# EAGLE design NitroxAnalyzer_v_0_3 (EAGLE 7.3.0)
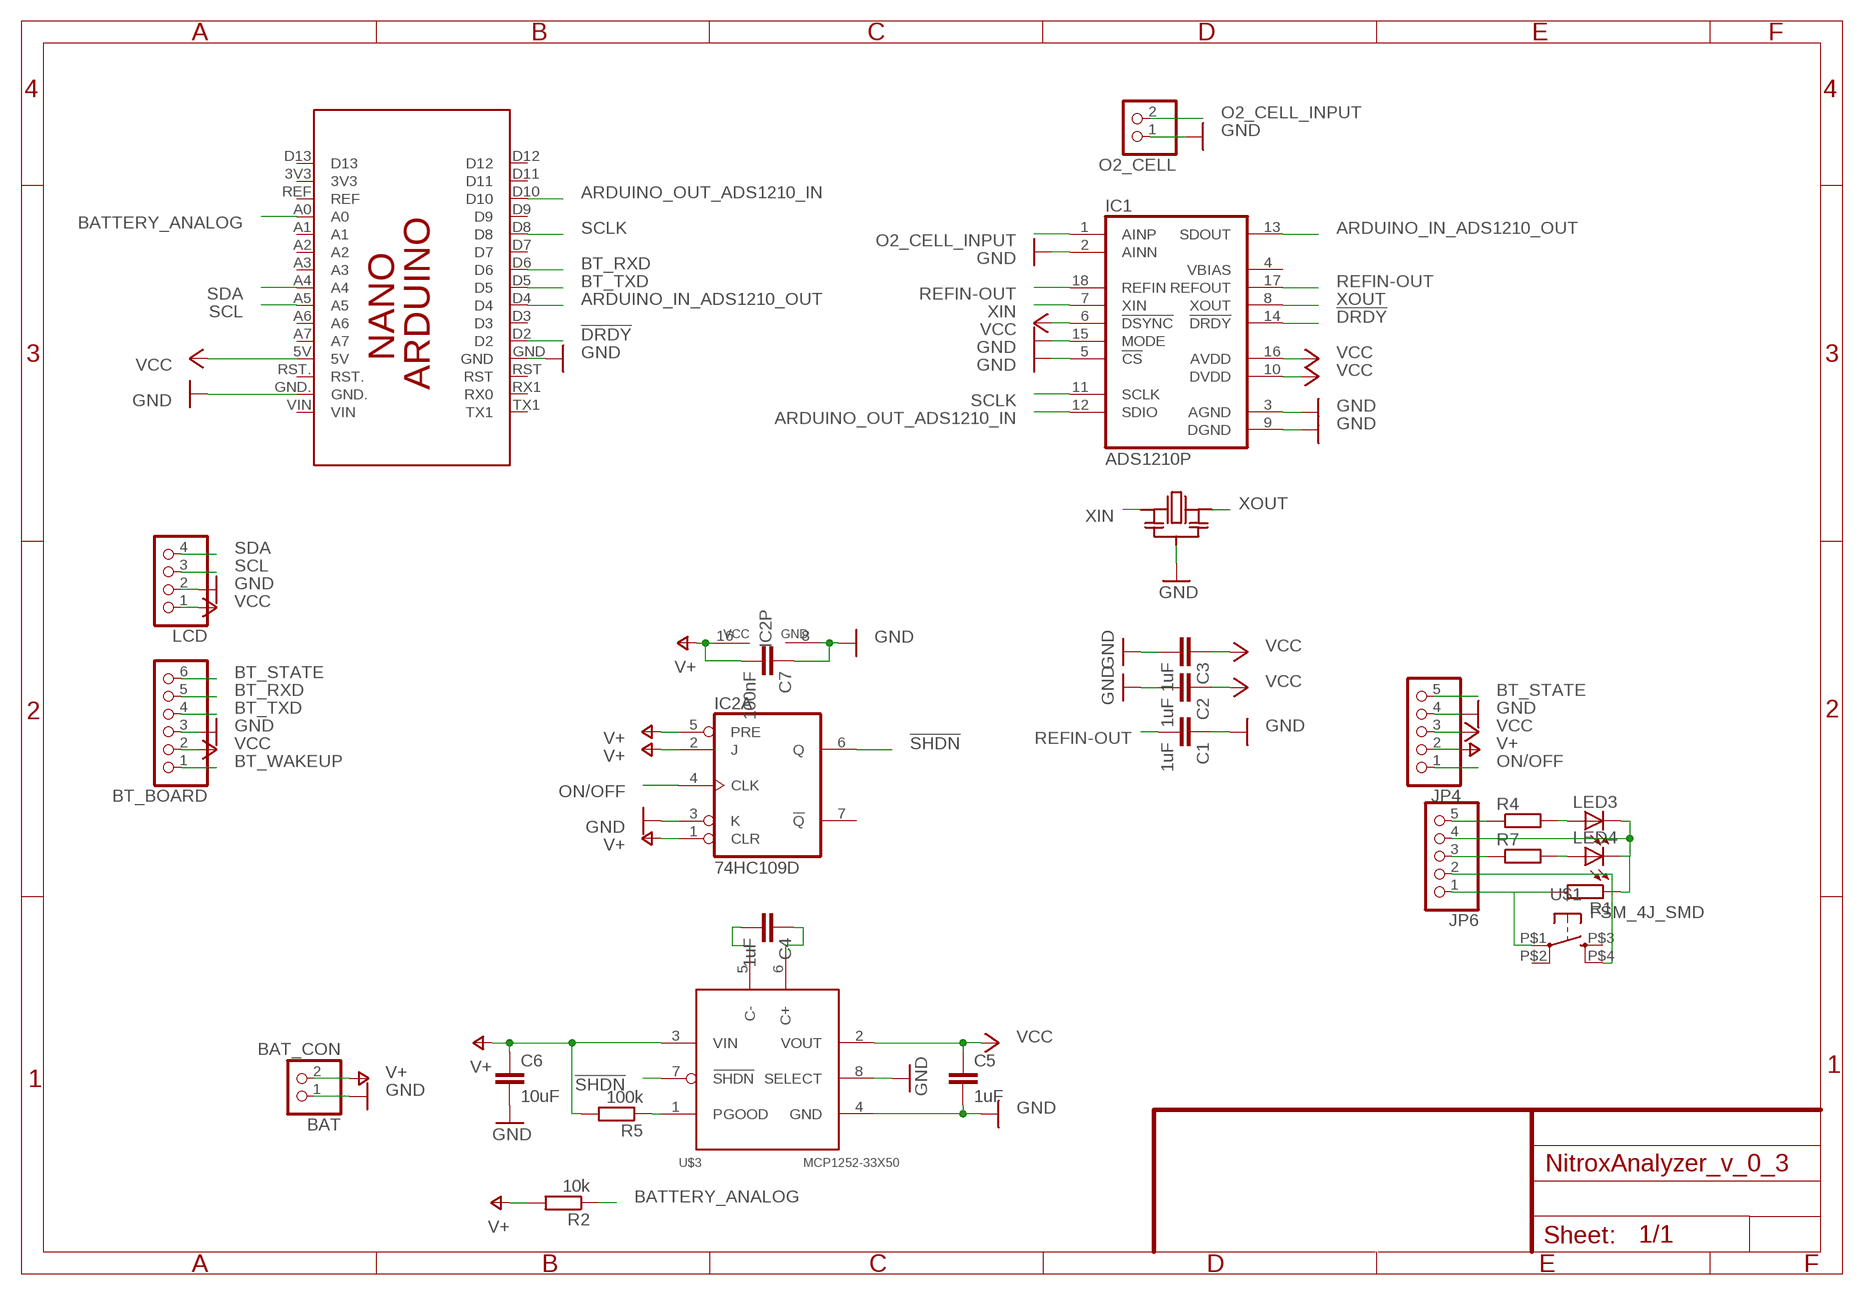
[diagram p0: schematic, sheet 1]

## Parts
BAT  BAT_CON  PINHD-1X2  [1X02]
BT_BOARD  PINHD-1X6  [1X06]
C1  1uF  C-EUC1206  [C1206]
C2  1uF  C-EUC1206  [C1206]
C3  1uF  C-EUC1206  [C1206]
C4  1uF  C-EUC1206  [C1206]
C5  1uF  C-EUC1206  [C1206]
C6  10uF  C-EUC1206  [C1206]
C7  100nF  C-EUC1206  [C1206]
IC1  ADS1210P  [DIL18]
IC2  74HC109D  [SO16]
JP4  PINHD-1X5  [1X05]
JP6  PINHD-1X5/90  [1X05/90]
LCD  PINHD-1X4  [1X04]
LED3  LEDSML0805  [SML0805]
LED4  LEDSML0805  [SML0805]
O2_CELL  PINHD-1X2  [1X02]
PCB1  ARDUINO_NANO_SOCKET  [ARDUINO_NANO_SOCKET]
R1  R-EU_R1206  [R1206]
R2  10k  R-EU_R1206  [R1206]
R4  R-EU_R1206  [R1206]
R5  100k  R-EU_R1206  [R1206]
R7  R-EU_R1206  [R1206]
U$1  FSM_4J_SMD  [B3F-10XX]
U$2  RESONATOR  [RESONATOR]
U$3  MCP1252-33X50  [MSOP8]

## Nets
!DRDY: IC1.14(!DRDY) PCB1.D2
!SHDN: IC2.6(A:Q) U$3.7(SHDN)
__GND: JP6.4 LED3.C LED4.C R1.1
_BT_STATE: JP6.5 R4.1
_ON_OFF: JP6.1 R1.2 U$1.P$1(P)
_V+: JP6.2 U$1.P$4(S1)
_VCC: JP6.3 R7.1
ARDUINO_IN_ADS1210_OUT: IC1.13(SDOUT) PCB1.D4
ARDUINO_OUT_ADS1210_IN: IC1.12(SDIO) PCB1.D10
BATTERY_ANALOG: PCB1.A0 R2.1
BT_RXD: BT_BOARD.5 PCB1.D6
BT_STATE: BT_BOARD.6 JP4.5
BT_TXD: BT_BOARD.4 PCB1.D5
BT_WAKEUP: BT_BOARD.1
GND: BAT.1 BT_BOARD.3 C1.1 C2.2 C3.2 C5.2 C6.2 C7.1 IC1.2(AINN) IC1.3(AGND) IC1.5(!CS) IC1.9(DGND) IC1.15(MODE) IC2.3(A:K) IC2.8(P:GND) JP4.4 LCD.2 O2_CELL.1 PCB1.GND PCB1.GND. U$2.P$2(GND) U$3.4(GND) U$3.8(SELECT)
N$4: C4.1 U$3.6(C+)
N$6: R5.1 U$3.1(PGOOD)
N$7: LED3.A R4.2
N$8: LED4.A R7.2
N$10: C4.2 U$3.5(C-)
O2_CELL_INPUT: IC1.1(AINP) O2_CELL.2
ON/OFF: IC2.4(A:CLK) JP4.1
REFIN-OUT: C1.2 IC1.17(REFOUT) IC1.18(REFIN)
SCL: LCD.3 PCB1.A5
SCLK: IC1.11(SCLK) PCB1.D8
SDA: LCD.4 PCB1.A4
V+: BAT.2 C6.1 C7.2 IC2.1(A:CLR) IC2.2(A:J) IC2.5(A:PRE) IC2.16(P:VCC) JP4.2 R2.2 R5.2 U$3.3(VIN)
VCC: BT_BOARD.2 C2.1 C3.1 C5.1 IC1.6(!DSYNC) IC1.10(DVDD) IC1.16(AVDD) JP4.3 LCD.1 PCB1.5V U$3.2(VOUT)
XIN: IC1.7(XIN) U$2.P$1(IN)
XOUT: IC1.8(XOUT) U$2.P$3(OUT)
Unconnected: IC1.4(VBIAS) IC2.7(A:!Q) IC2.9(B:!Q) IC2.10(B:Q) IC2.11(B:PRE) IC2.12(B:CLK) IC2.13(B:K) IC2.14(B:J) IC2.15(B:CLR) PCB1.3V3 PCB1.A1 PCB1.A2 PCB1.A3 PCB1.A6 PCB1.A7 PCB1.D3 PCB1.D7 PCB1.D9 PCB1.D11 PCB1.D12 PCB1.D13 PCB1.REF PCB1.RST PCB1.RST. PCB1.RX1(RX0) PCB1.TX1 PCB1.VIN U$1.P$2(P1) U$1.P$3(S)

## Library data of the parts
BAT O2_CELL = pinhead:PINHD-1X2: PIN HEADER
BT_BOARD = pinhead:PINHD-1X6: PIN HEADER
C1-C7 = rcl:C-EU: CAPACITOR, European symbol
IC1 = burr-brown:ADS1210: 24-Bit Analog-to-Digital Converter
IC2 = 74xx-eu:74*109: Dual J-K positive edge triggered FLIP FLOP, preset and clear
JP4 JP6 = pinhead:PINHD-1X5: PIN HEADER
LCD = pinhead:PINHD-1X4: PIN HEADER
LED3 LED4 = led:LED: LED OSRAM: - CHIPLED LG R971, LG N971, LY N971, LG Q971, LY Q971, LO R971, LY R971 LH N974, LH R974 LS Q976, LO Q976, LY Q976 LO Q996 - Hyper CHIPLED LW Q18S LB Q993, LB Q99A, LB R99A - SideLED LS A670, LO A670, LY A670, LG A670, LP A670 LB A673, LV A673, LT A673, LW A673 LH A674 LY A675 LS A676, LA A676, LO A676, LY A676, LW A676 LS A679, LY A679, LG A679 - Hyper Micro SIDELED® LS Y876, LA Y876, LO Y876, LY Y876 LT Y87S - SmartLED LW L88C, LW L88S LB L89C, LB L89S, LG L890 LS L89K, LO L89K, LY L89K LS L896, LA L896, LO L896, LY L896 - TOPLED LS T670, LO T670, LY T670, LG T670, LP T670 LSG T670, LSP T670, LSY T670, LOP T670, LYG T670 LG T671, LOG T671, LSG T671 LB T673, LV T673, LT T673, LW T673 LH T674 LS T676, LA T676, LO T676, LY T676, LB T676, LH T676, LSB T676, LW T676 LB T67C, LV T67C, LT T67C, LS T67K, LO T67K, LY T67K, LW E67C LS E67B, LA E67B, LO E67B, LY E67B, LB E67C, LV E67C, LT E67C LW T67C LS T679, LY T679, LG T679 LS T770, LO T770, LY T770, LG T770, LP T770 LB T773, LV T773, LT T773, LW T773 LH T774 LS E675, LA E675, LY E675, LS T675 LS T776, LA T776, LO T776, LY T776, LB T776 LHGB T686 LT T68C, LB T68C - Hyper Mini TOPLED® LB M676 - Mini TOPLED Santana® LG M470 LS M47K, LO M47K, LY M47K Source: http://www.osram.convergy.de LUXEON: - LUMILED® LXK2-PW12-R00, LXK2-PW12-S00, LXK2-PW14-U00, LXK2-PW14-V00 LXK2-PM12-R00, LXK2-PM12-S00, LXK2-PM14-U00 LXK2-PE12-Q00, LXK2-PE12-R00, LXK2-PE12-S00, LXK2-PE14-T00, LXK2-PE14-U00 LXK2-PB12-K00, LXK2-PB12-L00, LXK2-PB12-M00, LXK2-PB14-N00, LXK2-PB14-P00, LXK2-PB14-Q00 LXK2-PR12-L00, LXK2-PR12-M00, LXK2-PR14-Q00, LXK2-PR14-R00 LXK2-PD12-Q00, LXK2-PD12-R00, LXK2-PD12-S00 LXK2-PH12-R00, LXK2-PH12-S00 LXK2-PL12-P00, LXK2-PL12-Q00, LXK2-PL12-R00 Source: www.luxeon.com KINGBRIGHT: KA-3528ASYC Source: www.kingbright.com
PCB1 = arduino-sockets:ARDUINO_NANO_SOCKET: Device for representing an Arduino Nano board with a footprint in an EAGLE design. Created by Dave Young for Element14. More EAGLE documentation at: http://www.element14.com/community/community/knode/cadsoft_eagle
R1 R2 R4 R5 R7 = rcl:R-EU_: RESISTOR, European symbol
U$1 = fsm_4j:FSM_4J_SMD
U$2 = resonator:RESONATOR
U$3 = microchip-mcp125x-xxx:MCP1252-33X50

## Board
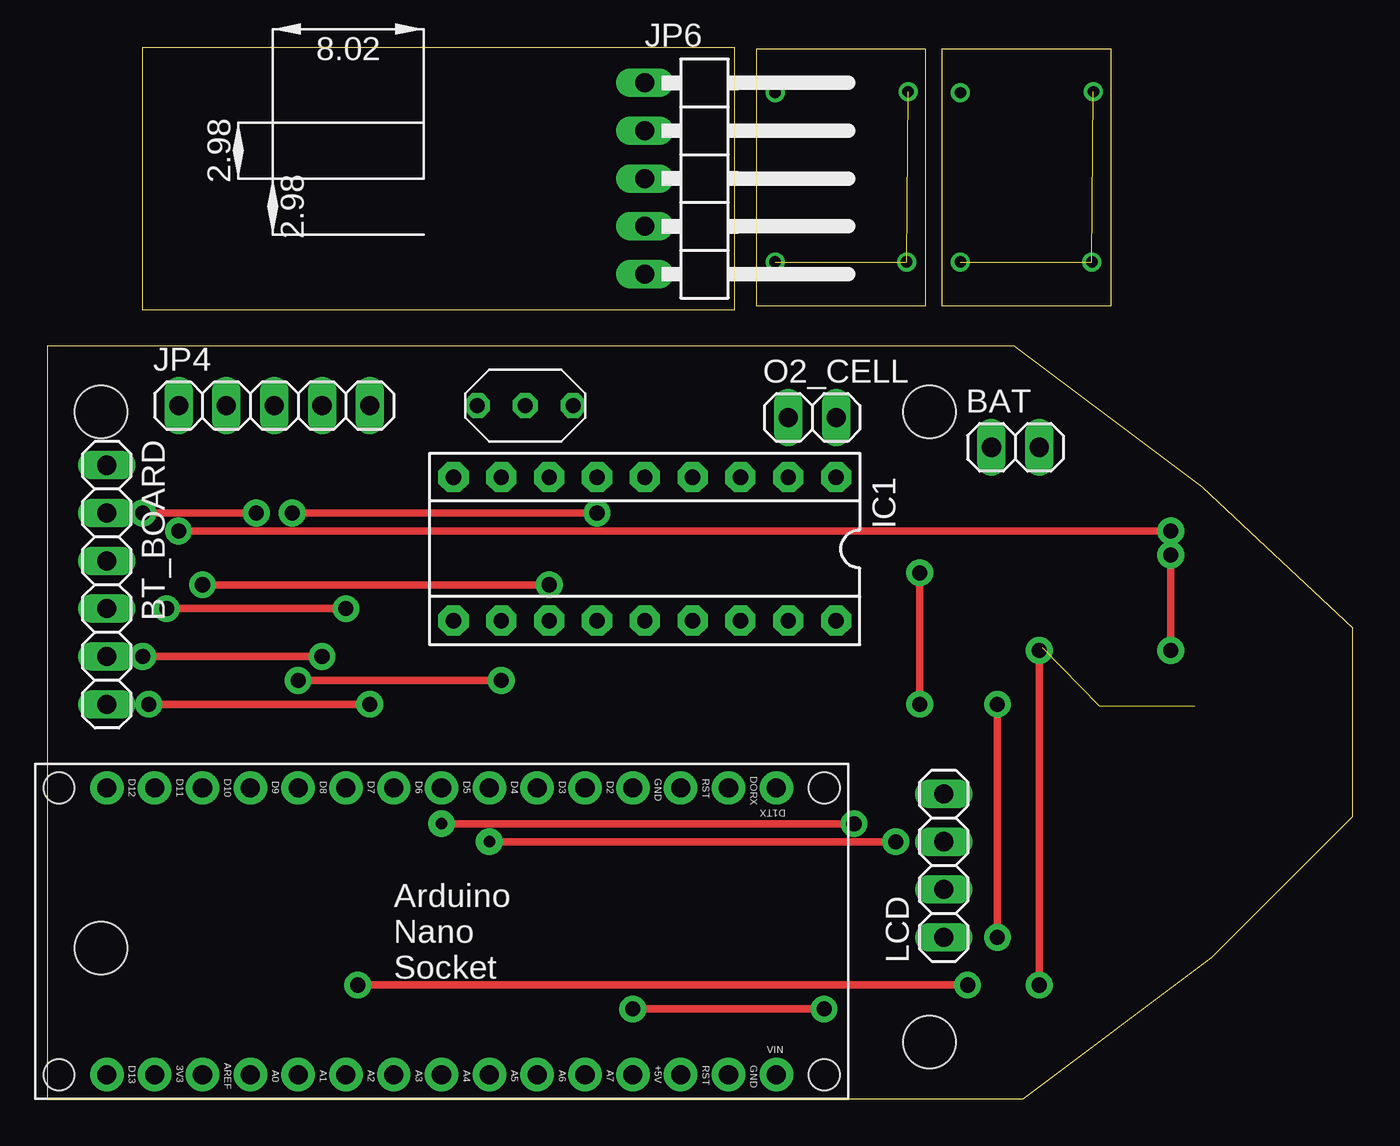
[diagram p1: board, top side]
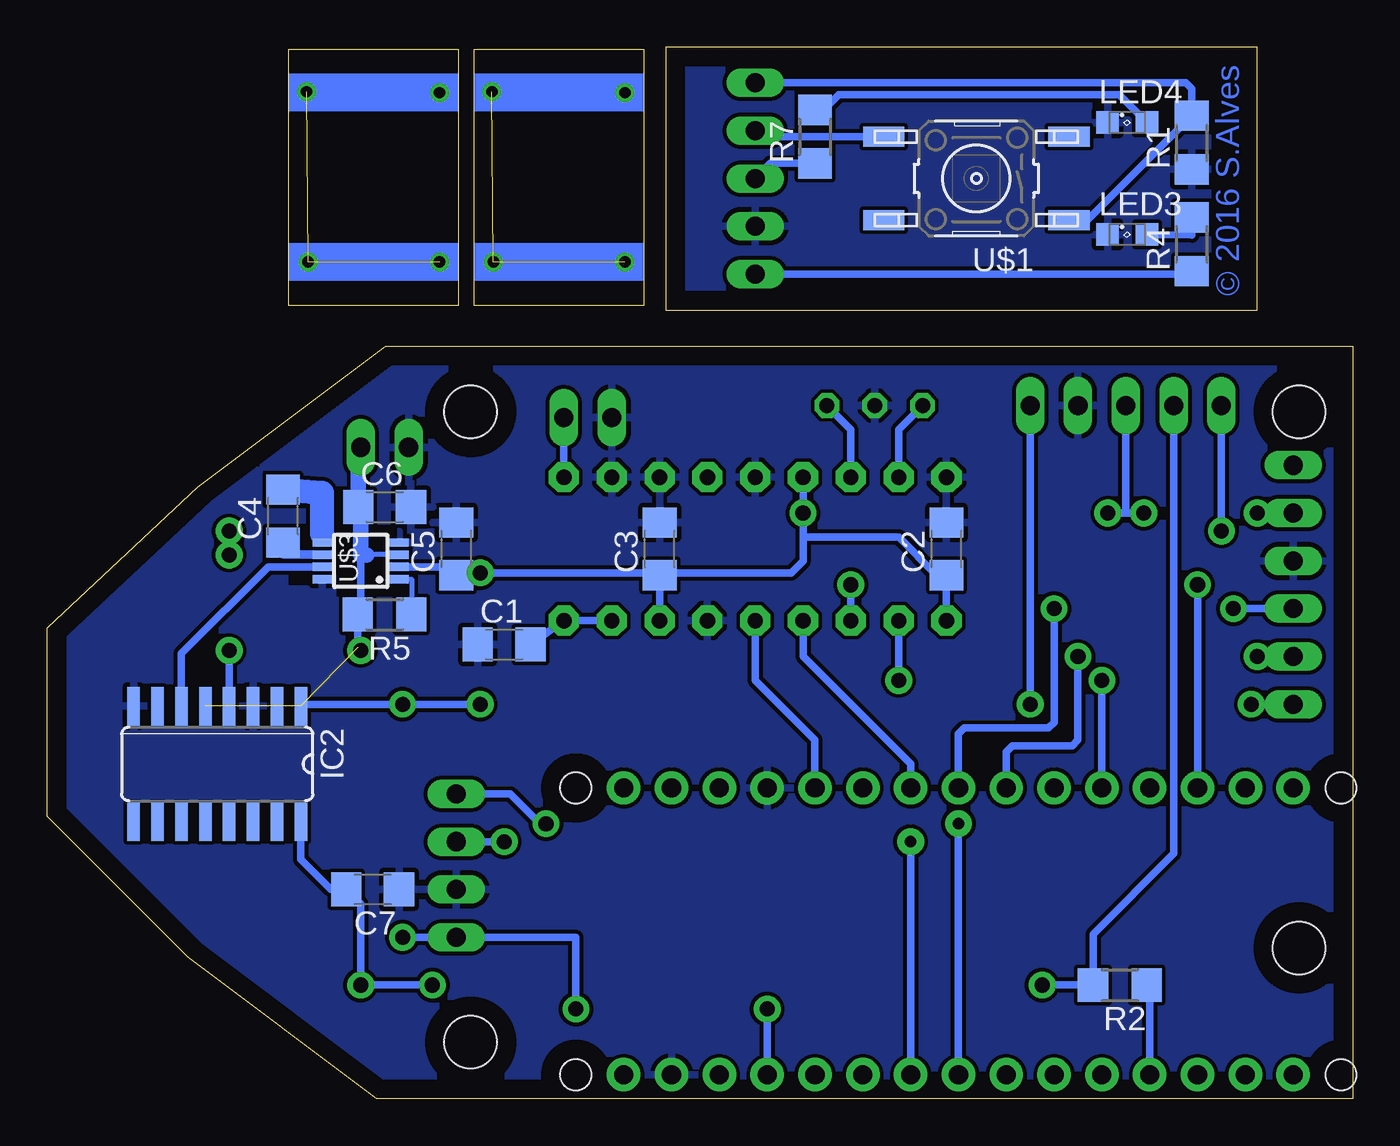
[diagram p2: board, bottom side, seen from below]

Size 69.36 x 55.88 mm. Coordinates in mm from the lower left corner, seen from the top.
Outline: 0,0 51.87,0 61.87,7.5 69.36,15 69.36,25 61.37,32.5 51.37,40 0,40 0,0
Outline: 5.08,41.91 5.08,55.88 36.51,55.88 36.51,41.91 5.08,41.91
Outline: 37.67,42.14 46.67,42.14 46.67,55.77 37.67,55.77 37.67,42.14
Outline: 47.52,42.14 56.52,42.14 56.52,55.77 47.52,55.77 47.52,42.14
Copper layers (1*16): Top 0.035mm / dielectric 1.5mm / Bottom 0.035mm
Design rules "default": minimum track width 10mil, minimum drill 24mil, track to track 8mil, track to pad 8mil, pad to pad 8mil, via to via 8mil, smd to smd 8mil, copper to edge 40mil, drill to drill 8mil, minimum pad ring 10mil, minimum via ring 8mil, stop-mask expansion 4mil, vias tented up to drill 0mil, thermal gap 10mil
Holes 2.8 mm at 2.87,8 46.87,3 2.87,36.5 46.87,36.5
bRestrict: area 51.4,26.7 to 54,30.5; area 50.8,26.7 to 51.4,30.5; area 55.2,27.3 to 56.5,29.8

### Footprints (pad centres in the part's own frame; a part is rotated, then mirrored left to right if it is on the bottom)
1X02 = drill 1.016 long: 1 -1.27,0; 2 1.27,0
1X06 = drill 1.016 long: 1 -6.35,0; 2 -3.81,0; 3 -1.27,0; 4 1.27,0; 5 3.81,0; 6 6.35,0
C1206 = smd 1.6 x 1.8: 1 -1.4,0; 2 1.4,0
DIL18 = drill 0.813 pad 1.6 octagon: 1 -10.16,-3.81; 2 -7.62,-3.81; 3 -5.08,-3.81; 4 -2.54,-3.81; 5 0,-3.81; 6 2.54,-3.81; 7 5.08,-3.81; 8 7.62,-3.81; 9 10.16,-3.81; 10 10.16,3.81; 11 7.62,3.81; 12 5.08,3.81; 13 2.54,3.81; 14 0,3.81; 15 -2.54,3.81; 16 -5.08,3.81; 17 -7.62,3.81; 18 -10.16,3.81
SO16 = smd 0.66 x 2.032: 1 -4.445,-3.073; 2 -3.175,-3.073; 3 -1.905,-3.073; 4 -0.635,-3.073; 5 0.635,-3.073; 6 1.905,-3.073; 7 3.175,-3.073; 8 4.445,-3.073; 9 4.445,3.073; 10 3.175,3.073; 11 1.905,3.073; 12 0.635,3.073; 13 -0.635,3.073; 14 -1.905,3.073; 15 -3.175,3.073; 16 -4.445,3.073
1X05 = drill 1.016 long: 1 -5.08,0; 2 -2.54,0; 3 0,0; 4 2.54,0; 5 5.08,0
1X05/90 = drill 1.016 long: 1 -5.08,-3.81; 2 -2.54,-3.81; 3 0,-3.81; 4 2.54,-3.81; 5 5.08,-3.81
1X04 = drill 1.016 long: 1 -3.81,0; 2 -1.27,0; 3 1.27,0; 4 3.81,0
SML0805 = smd 1.2 x 1.2: A 1.05,0; C -1.05,0
ARDUINO_NANO_SOCKET = drill 1.016 pad 1.778: 3V3 6.35,1.27; 5V 31.75,1.27; A0 11.43,1.27; A1 13.97,1.27; A2 16.51,1.27; A3 19.05,1.27; A4 21.59,1.27; A5 24.13,1.27; A6 26.67,1.27; A7 29.21,1.27; D2 29.21,16.51; D3 26.67,16.51; D4 24.13,16.51; D5 21.59,16.51; D6 19.05,16.51; D7 16.51,16.51; D8 13.97,16.51; D9 11.43,16.51; D10 8.89,16.51; D11 6.35,16.51; D12 3.81,16.51; D13 3.81,1.27; GND 31.75,16.51; GND. 36.83,1.27; REF 8.89,1.27; RST 34.29,16.51; RST. 34.29,1.27; RX1 36.83,16.51; TX1 39.37,16.51; VIN 39.37,1.27 | hole 1.651: 1.27,1.27; 1.27,16.51; 41.91,16.51; 41.91,1.27
R1206 = smd 1.6 x 1.803: 1 -1.422,0; 2 1.422,0
B3F-10XX = smd 2.184 x 1.067: P$1 -4.921,2.223; P$2 4.921,2.223; P$3 -4.921,-2.223; P$4 4.921,-2.223
RESONATOR = drill 0.8 octagon: P$1 -2.54,0; P$2 0,0; P$3 2.54,0
MSOP8 = smd 0.45 x 1: 1 -0.975,-2.05; 2 -0.325,-2.05; 3 0.325,-2.05; 4 0.975,-2.05; 5 0.975,2.05; 6 0.325,2.05; 7 -0.325,2.05; 8 -0.975,2.05

### Placement (x,y rotation side)
BAT  51.44,34.61 0 top
BT_BOARD  3.17,27.3 270 top
C1  45.09,24.13 0 bottom
C2  21.59,29.21 90 bottom
C3  36.83,29.21 90 bottom
C4  56.83,30.96 90 bottom
C5  47.62,29.21 90 bottom
C6  51.44,31.43 0 bottom
C7  52.07,11.11 180 bottom
IC1  31.75,29.21 180 top
IC2  60.33,17.78 180 bottom
JP4  12.06,36.83 0 top
JP6  35.56,48.9 270 top
LCD  47.62,12.38 90 top
LED3  11.99,45.92 0 bottom
LED4  11.99,51.87 0 bottom
O2_CELL  40.64,36.2 0 top
PCB1  -0.64,0 0 top
R1  8.57,50.8 90 bottom
R2  12.38,6.03 180 bottom
R4  8.57,45.4 90 bottom
R5  51.44,25.72 180 bottom
R7  28.57,51.12 90 bottom
U$1  20,48.9 180 bottom
U$2  25.4,36.83 180 top
U$3  52.71,28.57 90 bottom

### Tracks (layer width: path | path; a pad name or v marks a point on that pad's centre or on a via)
!DRDY
  Bottom 0.406: IC1.14 31.75,22.23 28.57,19.05 PCB1.D2
!SHDN
  Bottom 0.406: IC2.6 62.23,23.65 57.63,28.26 U$3.7
+3.7V1  (via drill 0.6)  (2 unrouted)
  other vias: 38.67,44.46 45.66,44.46 45.74,53.51
+3.7V2  (via drill 0.6)  (2 unrouted)
  other vias: 48.52,44.46 55.5,44.46 55.58,53.51
__GND
  pour Bottom: 4.45,41.59 4.45,56.2 38.73,56.2 38.73,41.59
_BT_STATE
  Bottom 0.406: JP6.5 8.57,43.81 R4.1
_ON_OFF
  Bottom 0.406: JP6.1 8.89,53.98 8.57,53.66 R1.2 14.12,46.67 U$1.P$1
_V+
  Bottom 0.406: U$1.P$4 31.43,51.12 JP6.2
_VCC
  Bottom 0.406: JP6.3 30.95,49.7 R7.1
ARDUINO_IN_ADS1210_OUT
  Bottom 0.406: IC1.13 29.21,23.5 23.49,17.78 PCB1.D4 | PCB1.D4
ARDUINO_OUT_ADS1210_IN  (via drill 0.8 pad 1.42)
  Top 0.406: v26.67,27.3 v8.26,27.3
  Bottom 0.406: IC1.12 v26.67,27.3 | v8.26,27.3 8.26,17.68 PCB1.D10
BATTERY_ANALOG
  Bottom 0.406: PCB1.A0 10.79,5.87 R2.1
BT_RXD  (via drill 0.8 pad 1.42)
  Top 0.406: v5.08,23.5 v14.61,23.5
  Bottom 0.406: BT_BOARD.5 v5.08,23.5 | v14.61,23.5 14.61,19.05 14.92,18.73 18.1,18.73 18.41,18.41 PCB1.D6
BT_STATE  (via drill 0.8 pad 1.42)
  Top 0.406: v5.4,20.95 v17.14,20.95
  Bottom 0.406: BT_BOARD.6 v5.4,20.95 | v17.14,20.95 JP4.5
BT_TXD  (via drill 0.8 pad 1.42)
  Top 0.406: v6.35,26.04 v15.88,26.04
  Bottom 0.406: BT_BOARD.4 v6.35,26.04 | v15.88,26.04 15.88,20.32 15.88,20 16.19,19.68 20.64,19.68 20.95,19.37 PCB1.D5 | PCB1.D5
GND
  pour Bottom: -1.27,-0.64 -1.27,40.64 51.44,40.64 53.98,40.64 69.21,25.4 69.21,14.61 53.98,-0.64
N$3  (via drill 0.6)
  other vias: 38.67,53.46
N$4
  Bottom 0.457: U$3.6 56.83,28.9 C4.1
N$5  (via drill 0.6)
  other vias: 48.52,53.46
N$6
  Bottom 0.254: U$3.1 50,27.6 R5.1
N$7
  Bottom 0.406: LED3.A 8.57,45.88 R4.2
N$8
  Bottom 0.406: LED4.A 12.4,53.34 27.3,53.34 28.11,52.54 R7.2
N$10
  Bottom 0.254: 54.77,30 54.76,30 U$3.5
  Bottom 1.27: C4.2 54.77,32.2 54.77,30
O2_CELL_INPUT
  Bottom 0.406: O2_CELL.2 IC1.1
ON/OFF  (via drill 0.8 pad 1.42)
  Top 0.406: v59.69,23.81 v59.69,28.89 | v59.69,30.16 v6.99,30.16
  Bottom 0.406: IC2.4 v59.69,23.81 | v59.69,28.89 v59.69,30.16 | v6.99,30.16 JP4.1
REFIN-OUT
  Bottom 0.406: IC1.17 IC1.18 C1.2
SCL  (via drill 0.6 pad 1.42, 0.8 pad 1.42)
  Top 0.406: v23.49,13.65 v45.09,13.65
  Bottom 0.406: PCB1.A5 23.49,12.7 v23.49,13.65 | v45.09,13.65 LCD.3
SCLK  (via drill 0.8 pad 1.42)
  Top 0.406: v13.34,22.23 v24.13,22.23
  Bottom 0.406: v24.13,22.23 IC1.11 | PCB1.D8 13.34,19.05 v13.34,22.23
SDA  (via drill 0.6 pad 1.42, 0.8 pad 1.42)
  Top 0.406: v20.95,14.61 v42.86,14.61
  Bottom 0.406: PCB1.A4 20.95,13.65 v20.95,14.61 | v42.86,14.61 43.18,14.61 44.77,16.19 LCD.4
V+  (via drill 0.8 pad 1.42)  (3 unrouted)
  Top 0.406: v52.71,23.81 v52.71,6.03 | v16.51,6.03 v48.9,6.03
  Bottom 0.254: U$3.3 52.07,28.9 52.39,28.89
  Bottom 0.406: 52.71,28.89 52.71,25.87 R5.2 52.86,23.96 v52.71,23.81 | v16.51,6.03 R2.2 13.8,8.74 9.53,13.02 JP4.2 | v48.9,6.03 v52.71,6.03 52.71,10.35 C7.2 54.29,11.11 55.88,12.7 IC2.16
  Bottom 0.813: 52.39,28.89 52.71,28.89 52.71,31.43 | BAT.2 52.84,34.61 C6.1
  Bottom 1.27: C6.1 52.71,31.43
VCC  (via drill 0.8 pad 1.42)
  Top 0.406: v31.11,4.76 v41.27,4.76 | v46.36,27.94 v46.36,20.95 | v50.48,8.57 v50.48,20.95 | v5.08,31.11 v11.11,31.11 | v13.02,31.11 v29.21,31.11
  Bottom 0.254: U$3.2 47.62,28.25 47.62,27.94 C5.1
  Bottom 0.406: 47.5,27.94 47.62,27.94 47.62,28.26 47.63,28.25 U$3.2 47.3,28.25 46.99,27.94 | v41.27,4.76 41.27,8.57 LCD.1 v50.48,8.57 | IC1.16 C3.1 | 29.21,29.84 29.21,28.57 29.84,27.94 36.7,27.94 C3.1 | 29.21,29.84 v29.21,31.11 IC1.6 | IC1.10 C2.1 22.09,27.81 24.13,29.84 29.21,29.84 | v31.11,4.76 31.11,3.17 | 31.11,3.17 31.11,2.86 | PCB1.5V 31.11,3.17 | 31.11,3.17 | v46.36,20.95 v50.48,20.95 55.78,20.95 | C3.1 36.83,27.94 v46.36,27.94 46.99,27.94 | 46.99,27.94 47.5,27.94 | 47.5,27.94 C5.1 | BT_BOARD.2 v5.08,31.11 | v11.11,31.11 12.06,31.11 | 12.06,31.11 v13.02,31.11 | JP4.3 12.06,31.11
XIN
  Bottom 0.406: IC1.7 26.67,35.56 U$2.P$1
XOUT
  Bottom 0.406: IC1.8 24.13,35.56 U$2.P$3
(copper drawn outside any net)
  shapes: Bottom area x8

### Text on the board
Bottom: © 2016 S.Alves
bRestrict: © 2016 Sergio Alves | All rights reserved | Version 0.3